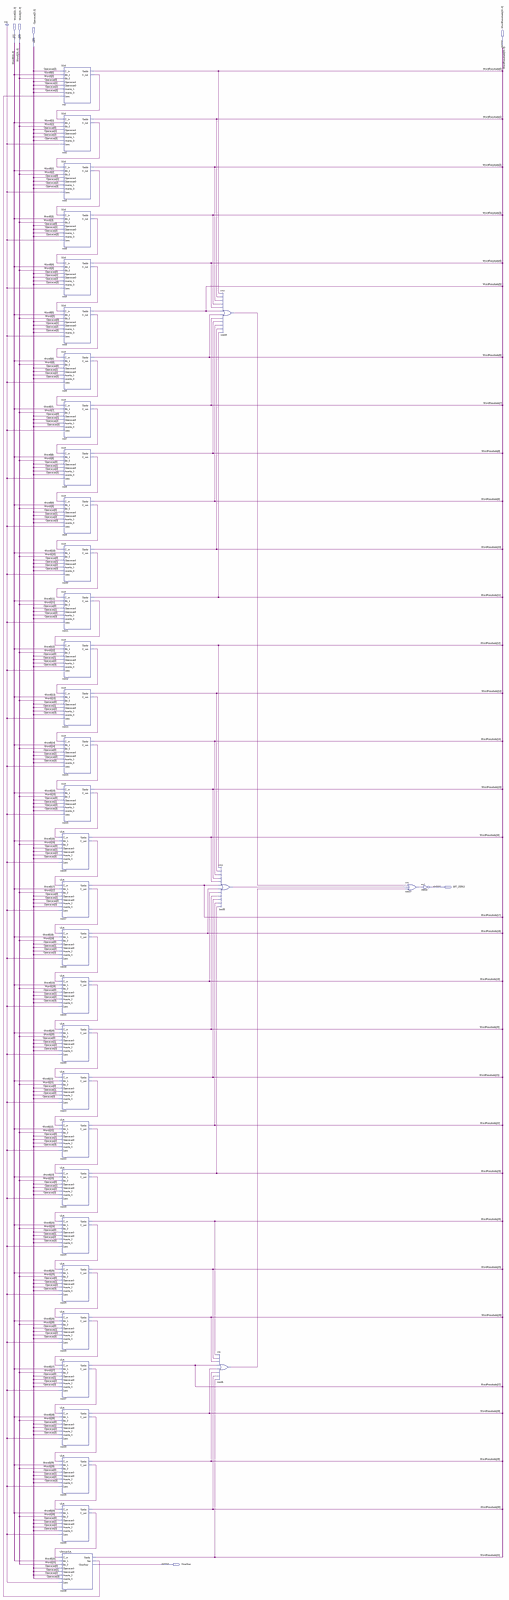
[diagram p0: schematic sheet, whole]
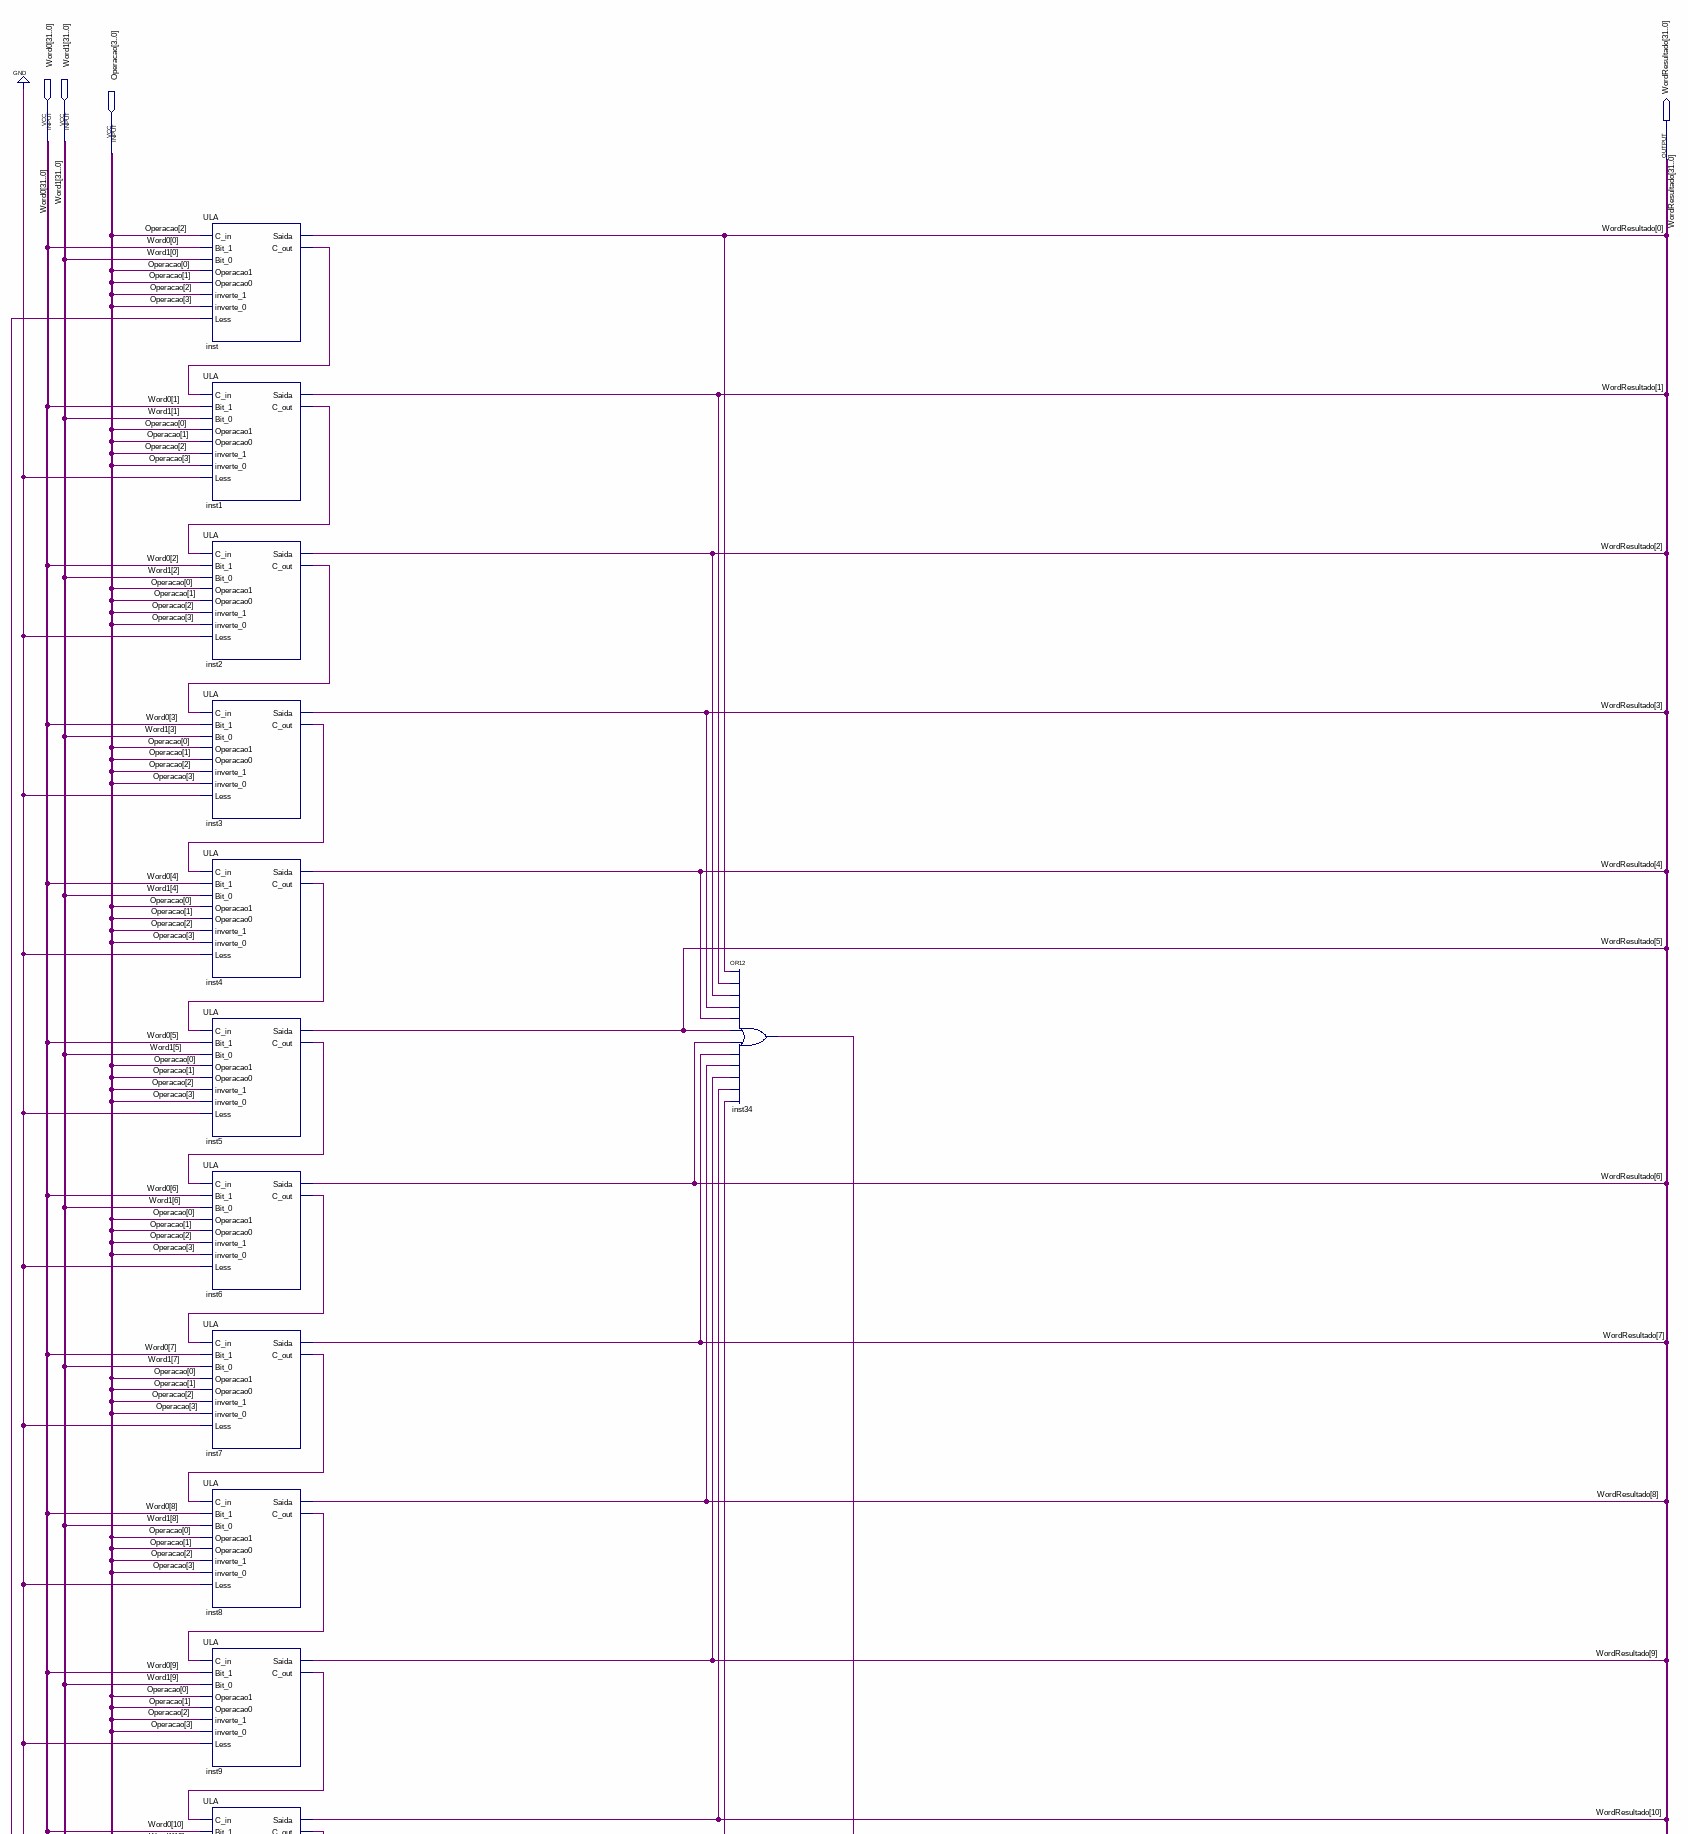
[diagram p1: schematic sheet, upper part]
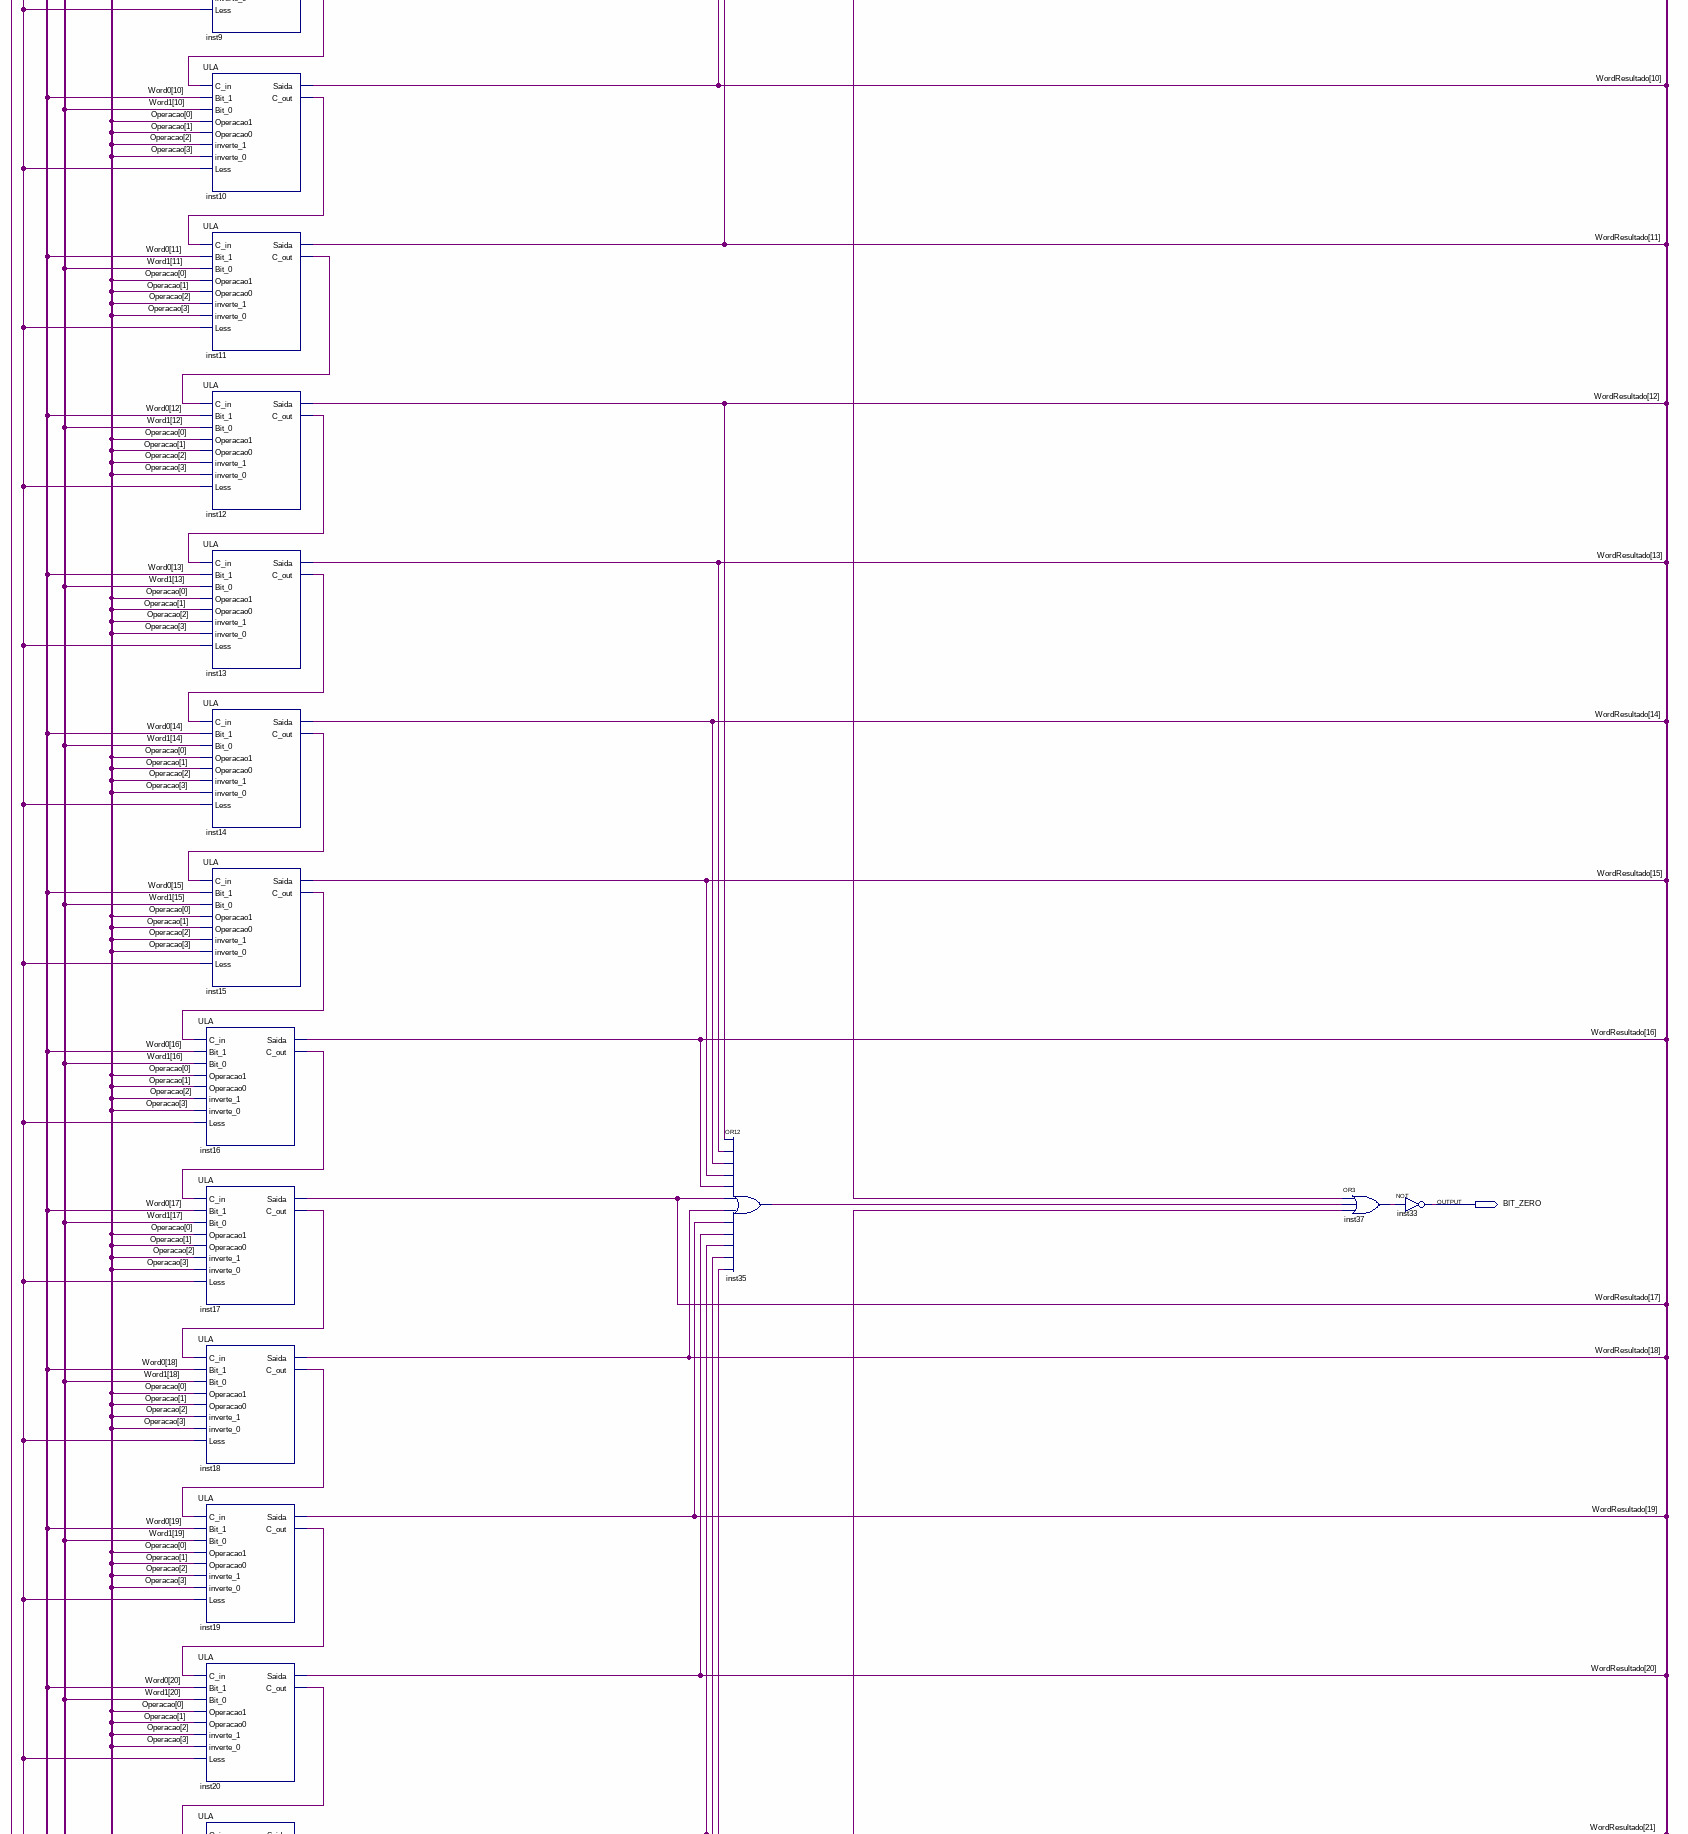
[diagram p2: schematic sheet, middle part]
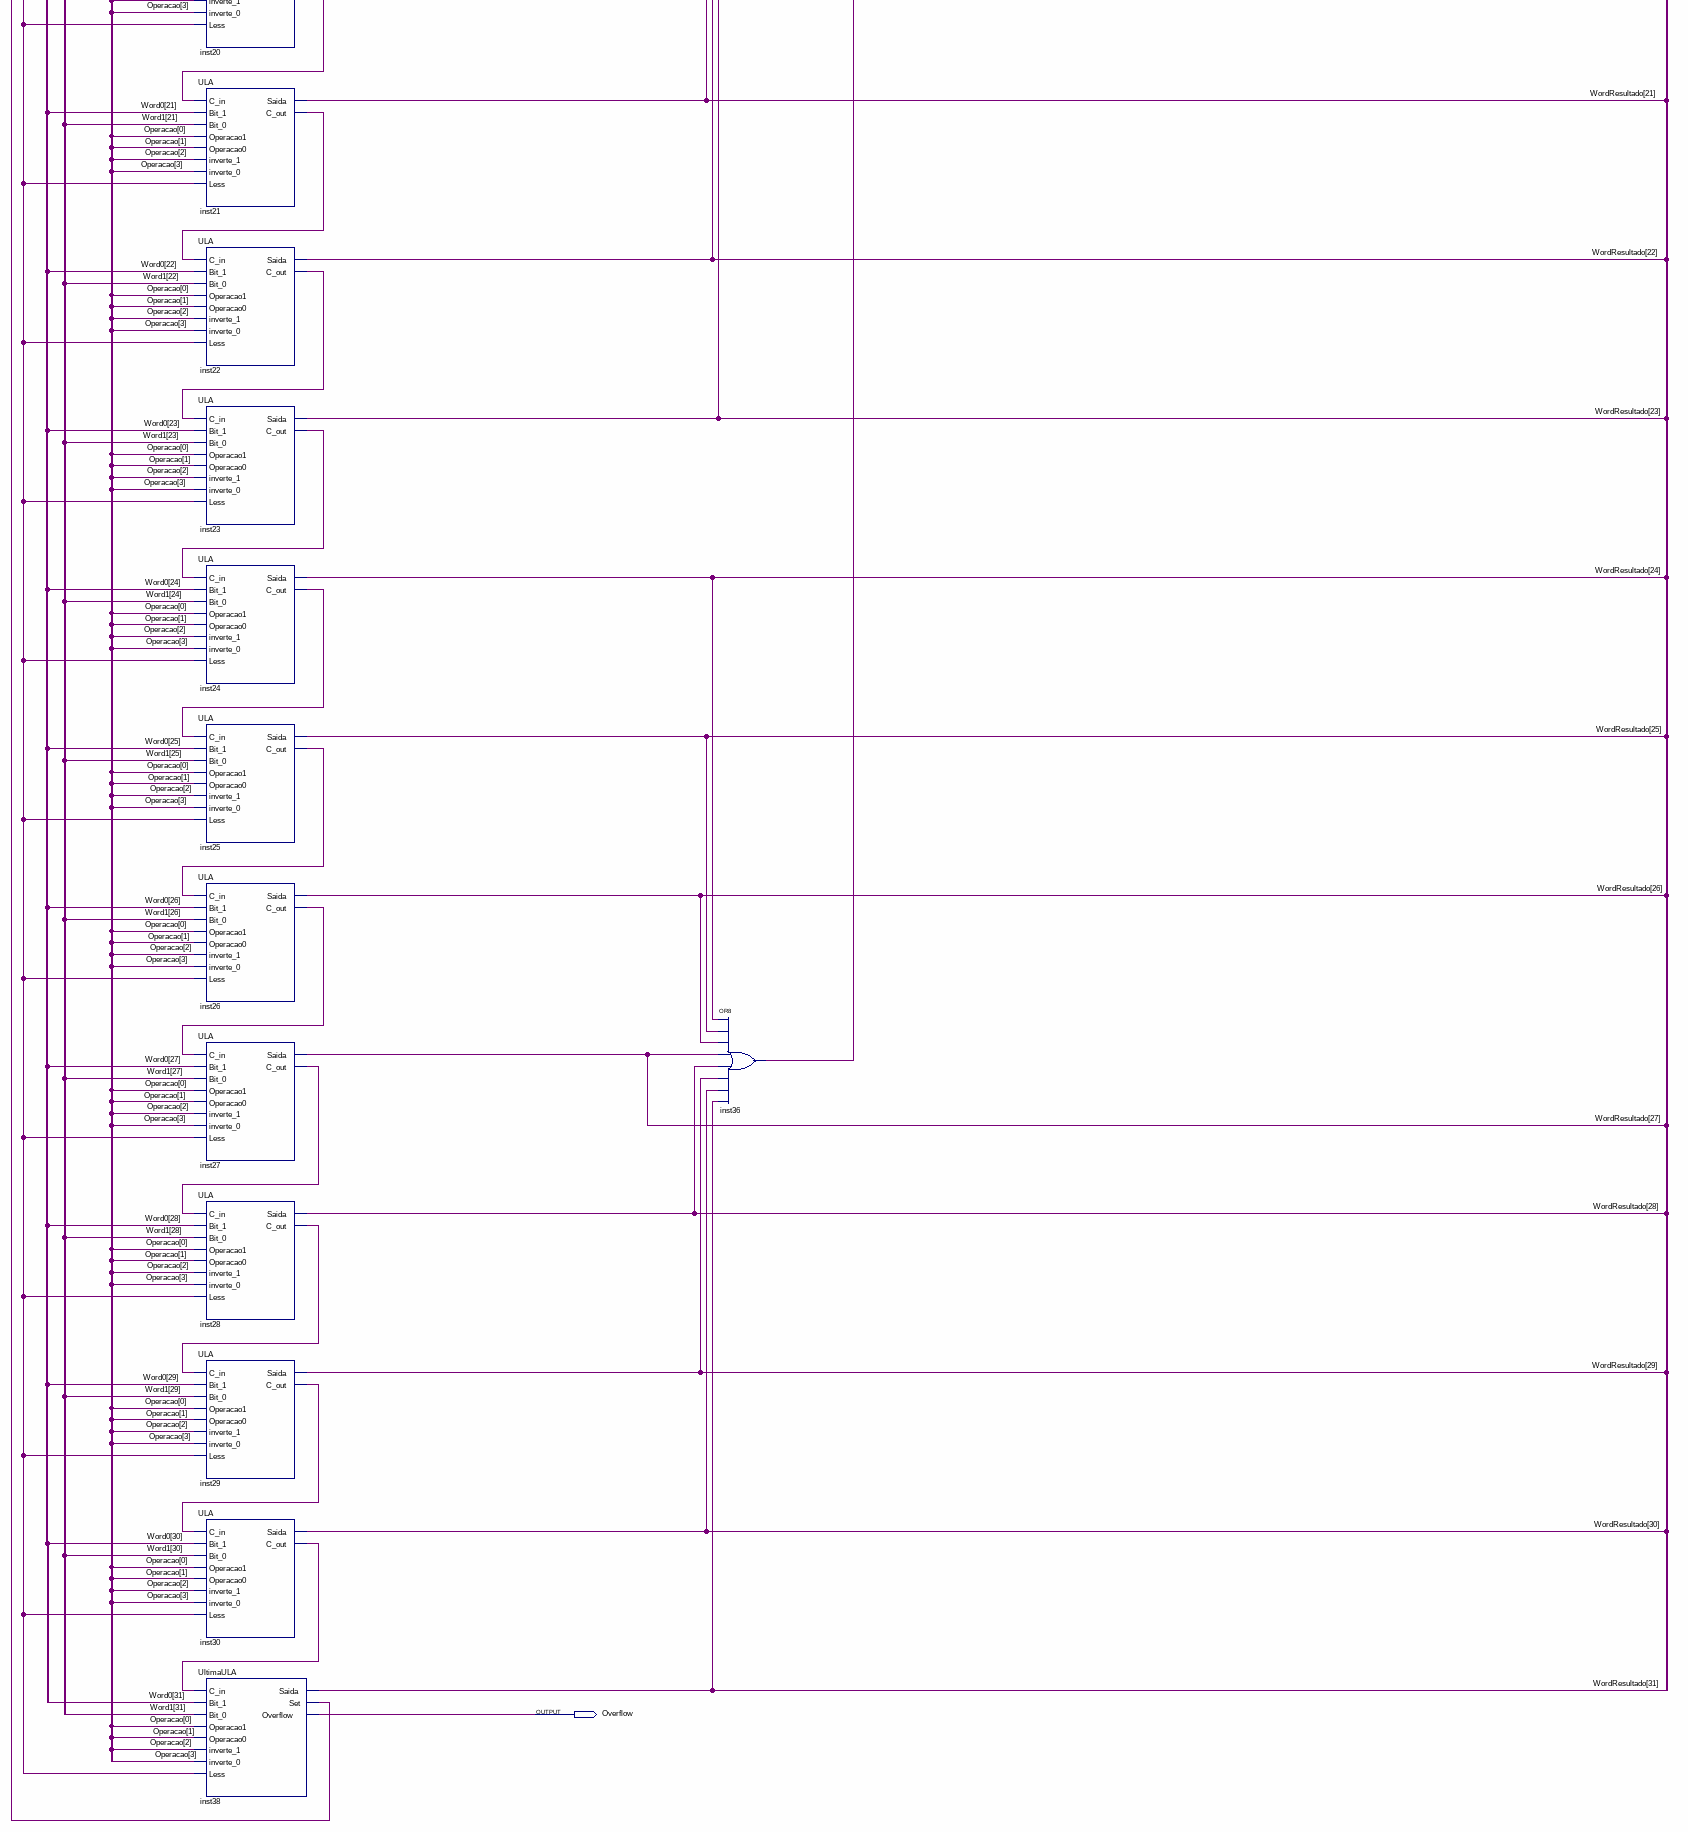
[diagram p3: schematic sheet, lower part]
// Quartus schematic ULA32.bdf as structural Verilog: 37 symbols, 6 pins
module ULA32 (
  input  [31:0] Word0,
  input  [31:0] Word1,
  input  [3:0] Operacao,
  output [31:0] WordResultado,
  output BIT_ZERO,
  output Overflow
);

  wire inst1_c_out, inst2_c_out, inst3_c_out, inst4_c_out, inst5_c_out, inst6_c_out, inst7_c_out,
       inst8_c_out, inst9_c_out, inst10_c_out, inst11_c_out, inst12_c_out, inst13_c_out, inst14_c_out,
       inst15_c_out, inst16_c_out, inst17_c_out, inst18_c_out, inst19_c_out, inst20_c_out, inst21_c_out,
       inst22_c_out, inst23_c_out, inst24_c_out, inst25_c_out, inst26_c_out, inst27_c_out, inst28_c_out,
       inst29_c_out, inst30_c_out, inst34_out, inst35_out, inst36_out, inst37_out, inst38_set, inst_c_out;

  ULA inst (
    .C_in(Operacao[2]), .Bit_1(Word0[0]), .Bit_0(Word1[0]), .inverte_0(Operacao[3]), .inverte_1(Operacao[2]),
    .Operacao0(Operacao[1]), .Operacao1(Operacao[0]), .Less(inst38_set), .Saida(WordResultado[0]),
    .C_out(inst_c_out));
  ULA inst1 (
    .C_in(inst_c_out), .Bit_1(Word0[1]), .Bit_0(Word1[1]), .inverte_0(Operacao[3]), .inverte_1(Operacao[2]),
    .Operacao0(Operacao[1]), .Operacao1(Operacao[0]), .Less(1'b0), .Saida(WordResultado[1]),
    .C_out(inst1_c_out));
  ULA inst2 (
    .C_in(inst1_c_out), .Bit_1(Word0[2]), .Bit_0(Word1[2]), .inverte_0(Operacao[3]), .inverte_1(Operacao[2]),
    .Operacao0(Operacao[1]), .Operacao1(Operacao[0]), .Less(1'b0), .Saida(WordResultado[2]),
    .C_out(inst2_c_out));
  ULA inst3 (
    .C_in(inst2_c_out), .Bit_1(Word0[3]), .Bit_0(Word1[3]), .inverte_0(Operacao[3]), .inverte_1(Operacao[2]),
    .Operacao0(Operacao[1]), .Operacao1(Operacao[0]), .Less(1'b0), .Saida(WordResultado[3]),
    .C_out(inst3_c_out));
  ULA inst4 (
    .C_in(inst3_c_out), .Bit_1(Word0[4]), .Bit_0(Word1[4]), .inverte_0(Operacao[3]), .inverte_1(Operacao[2]),
    .Operacao0(Operacao[1]), .Operacao1(Operacao[0]), .Less(1'b0), .Saida(WordResultado[4]),
    .C_out(inst4_c_out));
  ULA inst5 (
    .C_in(inst4_c_out), .Bit_1(Word0[5]), .Bit_0(Word1[5]), .inverte_0(Operacao[3]), .inverte_1(Operacao[2]),
    .Operacao0(Operacao[1]), .Operacao1(Operacao[0]), .Less(1'b0), .Saida(WordResultado[5]),
    .C_out(inst5_c_out));
  ULA inst6 (
    .C_in(inst5_c_out), .Bit_1(Word0[6]), .Bit_0(Word1[6]), .inverte_0(Operacao[3]), .inverte_1(Operacao[2]),
    .Operacao0(Operacao[1]), .Operacao1(Operacao[0]), .Less(1'b0), .Saida(WordResultado[6]),
    .C_out(inst6_c_out));
  ULA inst7 (
    .C_in(inst6_c_out), .Bit_1(Word0[7]), .Bit_0(Word1[7]), .inverte_0(Operacao[3]), .inverte_1(Operacao[2]),
    .Operacao0(Operacao[1]), .Operacao1(Operacao[0]), .Less(1'b0), .Saida(WordResultado[7]),
    .C_out(inst7_c_out));
  ULA inst8 (
    .C_in(inst7_c_out), .Bit_1(Word0[8]), .Bit_0(Word1[8]), .inverte_0(Operacao[3]), .inverte_1(Operacao[2]),
    .Operacao0(Operacao[1]), .Operacao1(Operacao[0]), .Less(1'b0), .Saida(WordResultado[8]),
    .C_out(inst8_c_out));
  ULA inst9 (
    .C_in(inst8_c_out), .Bit_1(Word0[9]), .Bit_0(Word1[9]), .inverte_0(Operacao[3]), .inverte_1(Operacao[2]),
    .Operacao0(Operacao[1]), .Operacao1(Operacao[0]), .Less(1'b0), .Saida(WordResultado[9]),
    .C_out(inst9_c_out));
  ULA inst10 (
    .C_in(inst9_c_out), .Bit_1(Word0[10]), .Bit_0(Word1[10]), .inverte_0(Operacao[3]),
    .inverte_1(Operacao[2]), .Operacao0(Operacao[1]), .Operacao1(Operacao[0]), .Less(1'b0),
    .Saida(WordResultado[10]), .C_out(inst10_c_out));
  ULA inst11 (
    .C_in(inst10_c_out), .Bit_1(Word0[11]), .Bit_0(Word1[11]), .inverte_0(Operacao[3]),
    .inverte_1(Operacao[2]), .Operacao0(Operacao[1]), .Operacao1(Operacao[0]), .Less(1'b0),
    .Saida(WordResultado[11]), .C_out(inst11_c_out));
  ULA inst12 (
    .C_in(inst11_c_out), .Bit_1(Word0[12]), .Bit_0(Word1[12]), .inverte_0(Operacao[3]),
    .inverte_1(Operacao[2]), .Operacao0(Operacao[1]), .Operacao1(Operacao[0]), .Less(1'b0),
    .Saida(WordResultado[12]), .C_out(inst12_c_out));
  ULA inst13 (
    .C_in(inst12_c_out), .Bit_1(Word0[13]), .Bit_0(Word1[13]), .inverte_0(Operacao[3]),
    .inverte_1(Operacao[2]), .Operacao0(Operacao[1]), .Operacao1(Operacao[0]), .Less(1'b0),
    .Saida(WordResultado[13]), .C_out(inst13_c_out));
  ULA inst14 (
    .C_in(inst13_c_out), .Bit_1(Word0[14]), .Bit_0(Word1[14]), .inverte_0(Operacao[3]),
    .inverte_1(Operacao[2]), .Operacao0(Operacao[1]), .Operacao1(Operacao[0]), .Less(1'b0),
    .Saida(WordResultado[14]), .C_out(inst14_c_out));
  ULA inst15 (
    .C_in(inst14_c_out), .Bit_1(Word0[15]), .Bit_0(Word1[15]), .inverte_0(Operacao[3]),
    .inverte_1(Operacao[2]), .Operacao0(Operacao[1]), .Operacao1(Operacao[0]), .Less(1'b0),
    .Saida(WordResultado[15]), .C_out(inst15_c_out));
  ULA inst16 (
    .C_in(inst15_c_out), .Bit_1(Word0[16]), .Bit_0(Word1[16]), .inverte_0(Operacao[3]),
    .inverte_1(Operacao[2]), .Operacao0(Operacao[1]), .Operacao1(Operacao[0]), .Less(1'b0),
    .Saida(WordResultado[16]), .C_out(inst16_c_out));
  ULA inst17 (
    .C_in(inst16_c_out), .Bit_1(Word0[17]), .Bit_0(Word1[17]), .inverte_0(Operacao[3]),
    .inverte_1(Operacao[2]), .Operacao0(Operacao[1]), .Operacao1(Operacao[0]), .Less(1'b0),
    .Saida(WordResultado[17]), .C_out(inst17_c_out));
  ULA inst18 (
    .C_in(inst17_c_out), .Bit_1(Word0[18]), .Bit_0(Word1[18]), .inverte_0(Operacao[3]),
    .inverte_1(Operacao[2]), .Operacao0(Operacao[1]), .Operacao1(Operacao[0]), .Less(1'b0),
    .Saida(WordResultado[18]), .C_out(inst18_c_out));
  ULA inst19 (
    .C_in(inst18_c_out), .Bit_1(Word0[19]), .Bit_0(Word1[19]), .inverte_0(Operacao[3]),
    .inverte_1(Operacao[2]), .Operacao0(Operacao[1]), .Operacao1(Operacao[0]), .Less(1'b0),
    .Saida(WordResultado[19]), .C_out(inst19_c_out));
  ULA inst20 (
    .C_in(inst19_c_out), .Bit_1(Word0[20]), .Bit_0(Word1[20]), .inverte_0(Operacao[3]),
    .inverte_1(Operacao[2]), .Operacao0(Operacao[1]), .Operacao1(Operacao[0]), .Less(1'b0),
    .Saida(WordResultado[20]), .C_out(inst20_c_out));
  ULA inst21 (
    .C_in(inst20_c_out), .Bit_1(Word0[21]), .Bit_0(Word1[21]), .inverte_0(Operacao[3]),
    .inverte_1(Operacao[2]), .Operacao0(Operacao[1]), .Operacao1(Operacao[0]), .Less(1'b0),
    .Saida(WordResultado[21]), .C_out(inst21_c_out));
  ULA inst22 (
    .C_in(inst21_c_out), .Bit_1(Word0[22]), .Bit_0(Word1[22]), .inverte_0(Operacao[3]),
    .inverte_1(Operacao[2]), .Operacao0(Operacao[1]), .Operacao1(Operacao[0]), .Less(1'b0),
    .Saida(WordResultado[22]), .C_out(inst22_c_out));
  ULA inst23 (
    .C_in(inst22_c_out), .Bit_1(Word0[23]), .Bit_0(Word1[23]), .inverte_0(Operacao[3]),
    .inverte_1(Operacao[2]), .Operacao0(Operacao[1]), .Operacao1(Operacao[0]), .Less(1'b0),
    .Saida(WordResultado[23]), .C_out(inst23_c_out));
  ULA inst24 (
    .C_in(inst23_c_out), .Bit_1(Word0[24]), .Bit_0(Word1[24]), .inverte_0(Operacao[3]),
    .inverte_1(Operacao[2]), .Operacao0(Operacao[1]), .Operacao1(Operacao[0]), .Less(1'b0),
    .Saida(WordResultado[24]), .C_out(inst24_c_out));
  ULA inst25 (
    .C_in(inst24_c_out), .Bit_1(Word0[25]), .Bit_0(Word1[25]), .inverte_0(Operacao[3]),
    .inverte_1(Operacao[2]), .Operacao0(Operacao[1]), .Operacao1(Operacao[0]), .Less(1'b0),
    .Saida(WordResultado[25]), .C_out(inst25_c_out));
  ULA inst26 (
    .C_in(inst25_c_out), .Bit_1(Word0[26]), .Bit_0(Word1[26]), .inverte_0(Operacao[3]),
    .inverte_1(Operacao[2]), .Operacao0(Operacao[1]), .Operacao1(Operacao[0]), .Less(1'b0),
    .Saida(WordResultado[26]), .C_out(inst26_c_out));
  ULA inst27 (
    .C_in(inst26_c_out), .Bit_1(Word0[27]), .Bit_0(Word1[27]), .inverte_0(Operacao[3]),
    .inverte_1(Operacao[2]), .Operacao0(Operacao[1]), .Operacao1(Operacao[0]), .Less(1'b0),
    .Saida(WordResultado[27]), .C_out(inst27_c_out));
  ULA inst28 (
    .C_in(inst27_c_out), .Bit_1(Word0[28]), .Bit_0(Word1[28]), .inverte_0(Operacao[3]),
    .inverte_1(Operacao[2]), .Operacao0(Operacao[1]), .Operacao1(Operacao[0]), .Less(1'b0),
    .Saida(WordResultado[28]), .C_out(inst28_c_out));
  ULA inst29 (
    .C_in(inst28_c_out), .Bit_1(Word0[29]), .Bit_0(Word1[29]), .inverte_0(Operacao[3]),
    .inverte_1(Operacao[2]), .Operacao0(Operacao[1]), .Operacao1(Operacao[0]), .Less(1'b0),
    .Saida(WordResultado[29]), .C_out(inst29_c_out));
  ULA inst30 (
    .C_in(inst29_c_out), .Bit_1(Word0[30]), .Bit_0(Word1[30]), .inverte_0(Operacao[3]),
    .inverte_1(Operacao[2]), .Operacao0(Operacao[1]), .Operacao1(Operacao[0]), .Less(1'b0),
    .Saida(WordResultado[30]), .C_out(inst30_c_out));
  UltimaULA inst38 (
    .C_in(inst30_c_out), .Bit_1(Word0[31]), .Bit_0(Word1[31]), .inverte_0(Operacao[3]),
    .inverte_1(Operacao[2]), .Operacao1(Operacao[0]), .Operacao0(Operacao[1]), .Less(1'b0),
    .Saida(WordResultado[31]), .Set(inst38_set), .Overflow(Overflow));
  or inst34 (inst34_out, WordResultado[0], WordResultado[1], WordResultado[2], WordResultado[3], WordResultado[4], WordResultado[5], WordResultado[6], WordResultado[7], WordResultado[8], WordResultado[9], WordResultado[10], WordResultado[11]);
  or inst35 (inst35_out, WordResultado[12], WordResultado[13], WordResultado[14], WordResultado[15], WordResultado[16], WordResultado[17], WordResultado[18], WordResultado[19], WordResultado[20], WordResultado[21], WordResultado[22], WordResultado[23]);
  or inst36 (inst36_out, WordResultado[24], WordResultado[25], WordResultado[26], WordResultado[27], WordResultado[28], WordResultado[29], WordResultado[30], WordResultado[31]);
  or inst37 (inst37_out, inst34_out, inst35_out, inst36_out);
  not inst33 (BIT_ZERO, inst37_out);
endmodule
